# EAGLE schematic Launch_Tower_Ignition_Board_v6-0 (EAGLE 6.2)
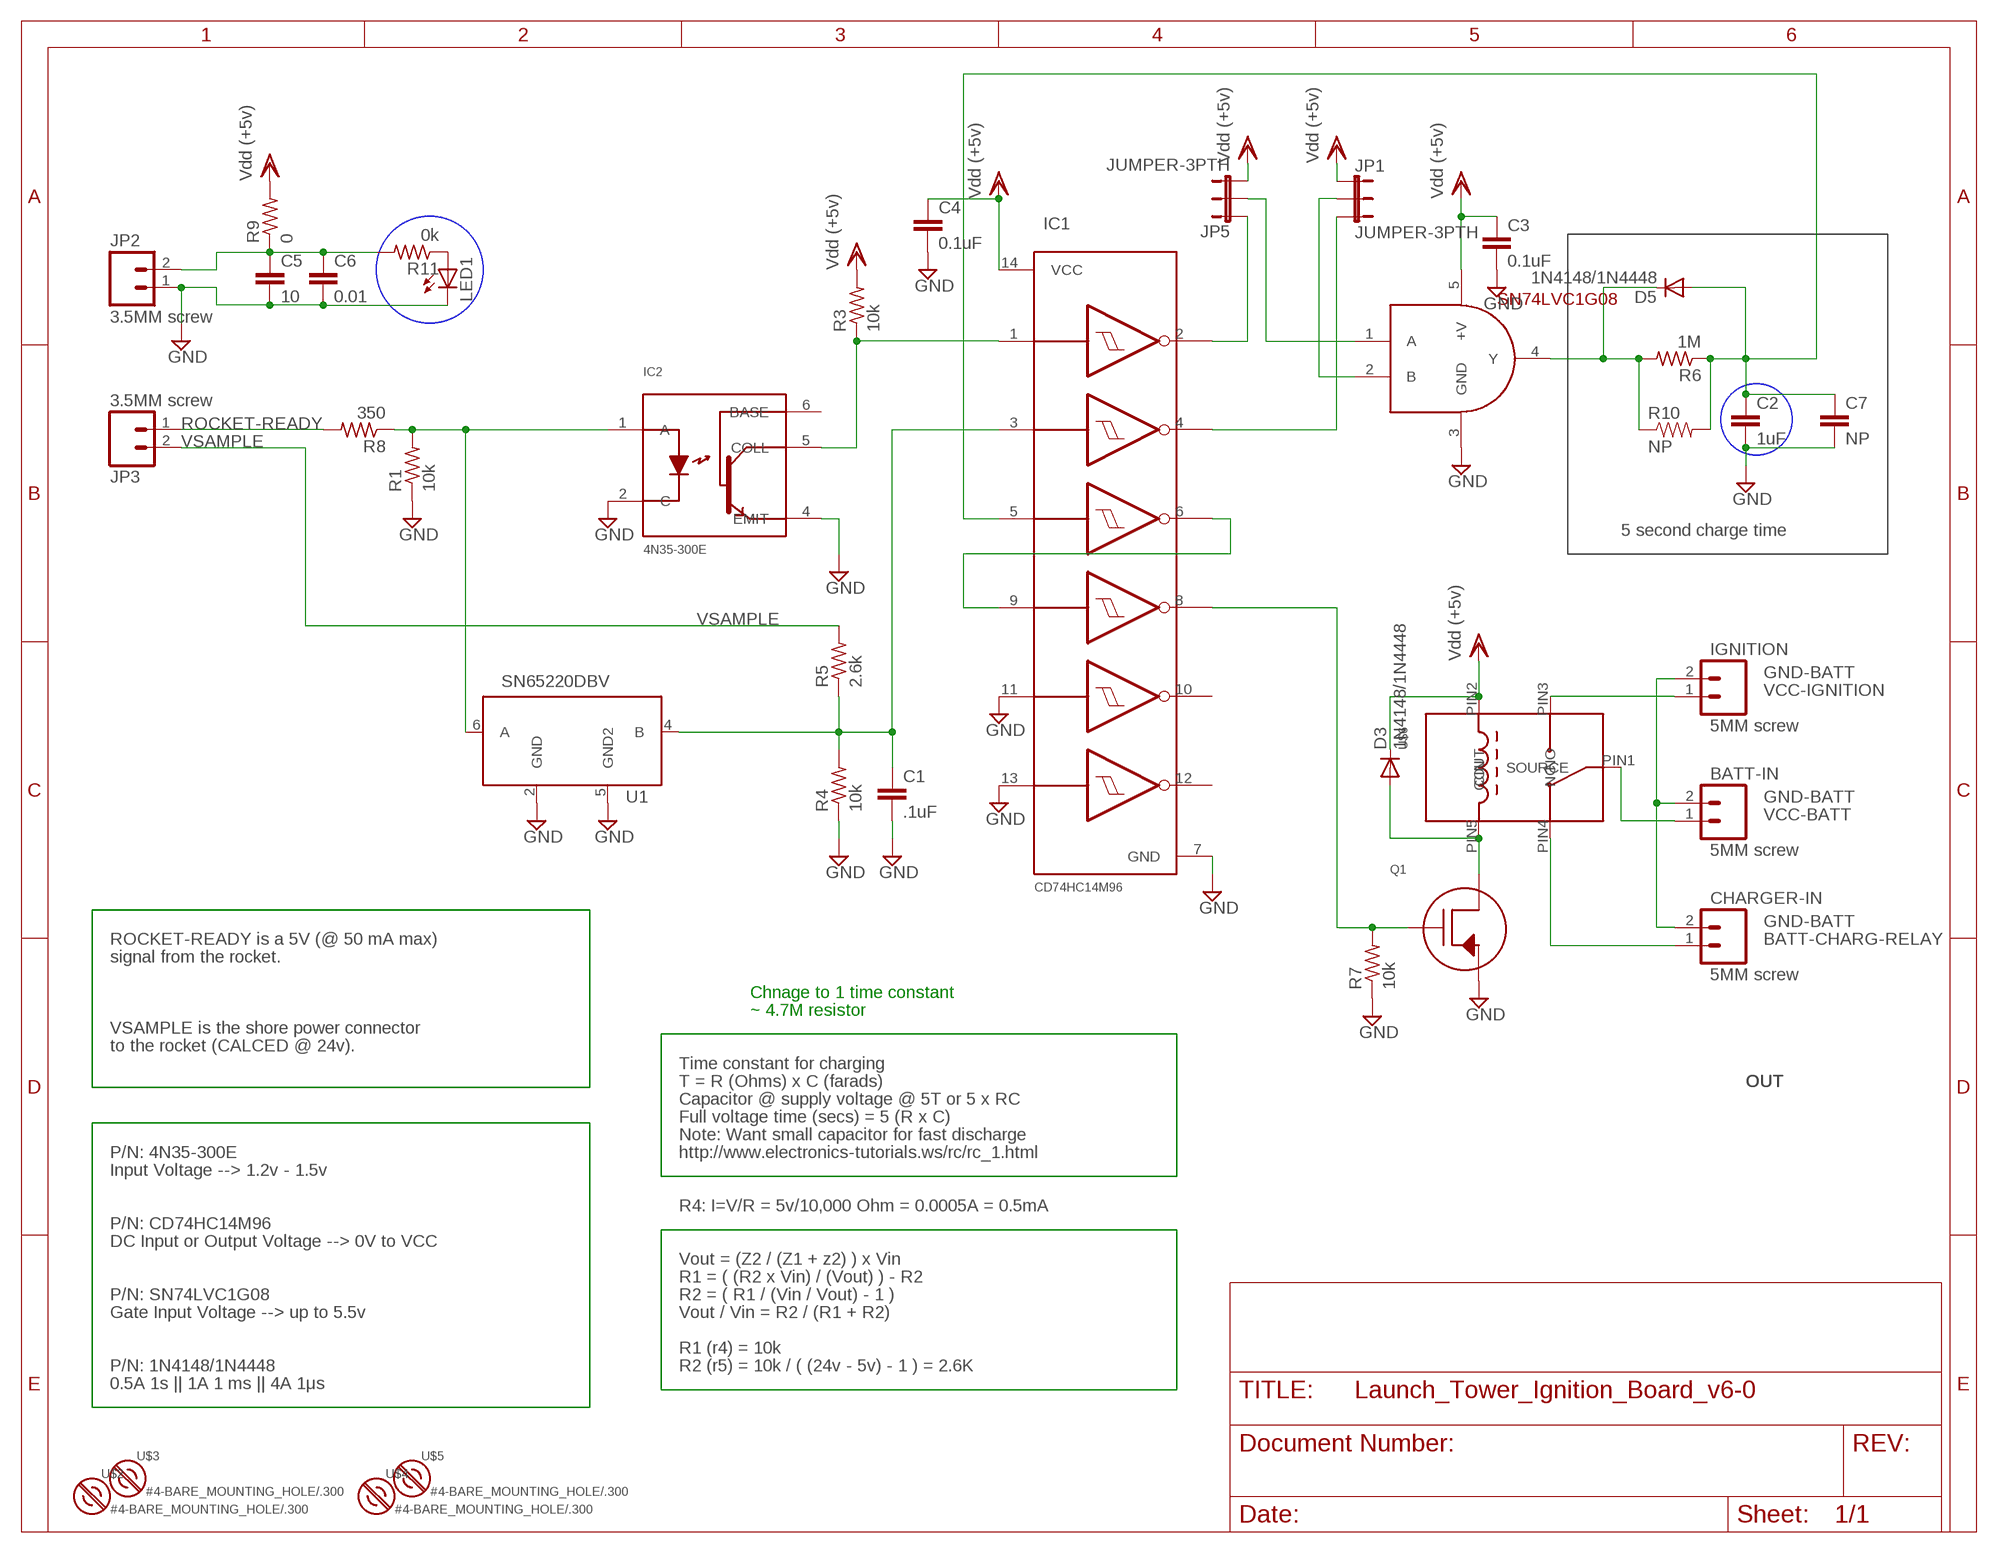
[diagram p0: schematic, sheet 1]

## Parts
BATT-IN  5MM screw  M025MM  [SCREWTERMINAL-5MM-2]
C1  .1uF  C-EU0805-B-NOSILK  [0805-B-NOSILK]
C2  1uF  C-EU0805-B-NOSILK  [0805-B-NOSILK]
C3  0.1uF  C-EU0805-B-NOSILK  [0805-B-NOSILK]
C4  0.1uF  C-EU0805-B-NOSILK  [0805-B-NOSILK]
C5  10  C-EU0805-B-NOSILK  [0805-B-NOSILK]
C6  0.01  C-EU0805-B-NOSILK  [0805-B-NOSILK]
C7  NP  CAPPTH  [CAP-PTH-SMALL]
CHARGER-IN  5MM screw  M025MM  [SCREWTERMINAL-5MM-2]
D3  1N4148/1N4448  DIODEPTH  [DIODE-1N4001]
D5  1N4148/1N4448  DIODEPTH  [DIODE-1N4001]
IC1  INVERT GATES  HEX_INV_SHMITT_TRIG  [INVERTSOIC14]
IC2  OPTOISOLATOR  [4N35-300E]
IGNITION  5MM screw  M025MM  [SCREWTERMINAL-5MM-2]
JP1  JUMPER-3PTH  [1X03]
JP2  3.5MM screw  M023.5MM  [SCREWTERMINAL-3.5MM-2]
JP3  3.5MM screw  M023.5MM  [SCREWTERMINAL-3.5MM-2]
JP5  JUMPER-3PTH  [1X03]
LED1  LED-FKIT-1206  [FKIT-LED-1206]
Q1  NMOSFET  [FETSO-8]
R1  10k  R-US_0805-B-NOSILK  [0805-B-NOSILK]
R3  10k  R-US_0805-B-NOSILK  [0805-B-NOSILK]
R4  10k  R-US_0805-B-NOSILK  [0805-B-NOSILK]
R5  2.6k  R-US_0805-B-NOSILK  [0805-B-NOSILK]
R6  1M  R-US_0805-B-NOSILK  [0805-B-NOSILK]
R7  10k  R-US_0805-B-NOSILK  [0805-B-NOSILK]
R8  350  R-US_0805-B-NOSILK  [0805-B-NOSILK]
R9  0  R-US_0805-B-NOSILK  [0805-B-NOSILK]
R10  NP  RESISTORPTH-1/4W  [AXIAL-0.4]
R11  0k  R-US_0805-B-NOSILK  [0805-B-NOSILK]
U1  SN65220DBV  [SOT23-6L]
U$1  AND GATE  SN74LVC1G08  [SOT23-5]
U$2  #4-BARE_MOUNTING_HOLE/.300  [#4/.300-BARE+STD_NUT_OR_STAR_WASHER]
U$3  #4-BARE_MOUNTING_HOLE/.300  [#4/.300-BARE+STD_NUT_OR_STAR_WASHER]
U$4  #4-BARE_MOUNTING_HOLE/.300  [#4/.300-BARE+STD_NUT_OR_STAR_WASHER]
U$5  #4-BARE_MOUNTING_HOLE/.300  [#4/.300-BARE+STD_NUT_OR_STAR_WASHER]
U$6  RELAY-2  [G5LA]

## Nets
BATT-CHARG-RELAY: CHARGER-IN.1 U$6.PIN4(NC)
GND: C1.2 C2.2 C3.2 C4.2 C5.2 C6.2 C7.2 IC1.7(GND) IC1.11(5A) IC1.13(6A) IC2.2(C) IC2.4(EMIT) JP2.1 LED1.C Q1.1(SOURCE) R1.1 R4.1 R7.1 U1.2(GND) U1.5(GND2) U$1.3(GND)
GND-BATT: BATT-IN.2 CHARGER-IN.2 IGNITION.2
N$1: JP1.2 U$1.2(B)
N$2: LED1.A R11.1
N$3: IC1.1(1A) IC2.5(COLL) R3.1
N$4: JP3.1 R8.2
N$5: JP5.2 U$1.1(A)
N$6: IC1.4(2Y) JP1.3
N$7: C1.1 IC1.3(2A) R4.2 R5.1 U1.4(B)
N$9: D3.A Q1.5(DRAIN) U$6.PIN5(CIN)
N$10: IC1.8(4Y) Q1.4(GATE) R7.2
N$11: IC1.2(1Y) JP5.1
N$12: C5.1 C6.1 JP2.2 R9.1 R11.2
N$13: D5.C R6.2 R10.P$1 U$1.4(Y)
N$15: C2.1 C7.1 D5.A IC1.5(3A) R6.1 R10.P$2
N-NOT2: IC1.6(3Y) IC1.9(4A)
ROCKET-READY: IC2.1(A) R1.2 R8.1 U1.6(A)
VCC-BATT: BATT-IN.1 U$6.PIN1(SOURCE)
VCC-IGNITION: IGNITION.1 U$6.PIN3(NO)
VDD: C3.1 C4.1 D3.C IC1.14(VCC) JP1.1 JP5.3 R3.2 R9.2 U$1.5(+V) U$6.PIN2(COUT) ; supply symbol labelled Vdd (+5v)
VSAMPLE: JP3.2 R5.2
Unconnected: IC1.10(5Y) IC1.12(6Y) IC2.6(BASE)

## Notes on the sheet
- 5 second charge time
- ROCKET-READY is a 5V (@ 50 mA max)
- signal from the rocket.
- Chnage to 1 time constant
- ~ 4.7M resistor
- VSAMPLE is the shore power connector
- to the rocket (CALCED @ 24v).
- Time constant for charging
- T = R (Ohms) x C (farads) | OUT | OUT | OUT | OUT
- Capacitor @ supply voltage @ 5T or 5 x RC
- Full voltage time (secs) = 5 (R x C)
- Note: Want small capacitor for fast discharge
- P/N: 4N35-300E | http://www.electronics-tutorials.ws/rc/rc_1.html
- Input Voltage --> 1.2v - 1.5v
- R4: I=V/R = 5v/10,000 Ohm = 0.0005A = 0.5mA
- P/N: CD74HC14M96
- DC Input or Output Voltage --> 0V to VCC
- Vout = (Z2 / (Z1 + z2) ) x Vin
- R1 = ( (R2 x Vin) / (Vout) ) - R2
- P/N: SN74LVC1G08 | R2 = ( R1 / (Vin / Vout) - 1 )
- Gate Input Voltage --> up to 5.5v | Vout / Vin = R2 / (R1 + R2)
- R1 (r4) = 10k
- P/N: 1N4148/1N4448 | R2 (r5) = 10k / ( (24v - 5v) - 1 ) = 2.6K
- 0.5A 1s || 1A 1 ms || 4A 1μs

## Library data of the parts
BATT-IN CHARGER-IN IGNITION JP2 JP3 = SparkFun:M02: Header 2 Standard 2-pin 0.1" header. Use with straight break away headers (SKU : PRT-00116), right angle break away headers (PRT-00553), swiss pins (PRT-00743), machine pins (PRT-00117), and female headers (PRT-00115). Molex polarized connector foot print use with SKU : PRT-08233 with associated crimp pins and housings.
C1-C6 = rcl_custom:C-EU: CAPACITOR, European symbol
C7 = SparkFun:CAP: Capacitor Standard 0603 ceramic capacitor, and 0.1" leaded capacitor.
D3 D5 = SparkFun:DIODE: Diode These are standard reverse protection diodes and small signal diodes. SMA package can handle up to about 1A. SOD-323 can handle about 200mA. What the SOD-323 package when ordering, there are some mfgs out there that are 5-pin packages.
IC1 = launch-tower:HEX_INV_SHMITT_TRIG: Single Schmitt-Trigger Inverter Gate
IC2 = launch-tower:OPTOISOLATOR
JP1 JP5 = SparkFun:JUMPER-3
LED1 = SparkFun:LED: LEDs Standard schematic elements and footprints for 5mm, 3mm, 1206, and 0603 sized LEDs. 5mm - Spark Fun Electronics SKU : COM-00529 (and others)
Q1 = launch-tower:NMOSFET
R1 R3-R9 R11 = rcl_custom:R-US_: RESISTOR, American symbol
R10 = SparkFun:RESISTOR: Resistor Basic schematic elements and footprints for 0603, 1206, and PTH resistors.
U1 = sn65220:SN65220
U$1 = SparkFun:SN74LVC1G08
U$2-U$5 = mount:#4-BARE_MOUNTING_HOLE: 1/8" drill hole for #4 screw mount
U$6 = launch-tower:RELAY-2